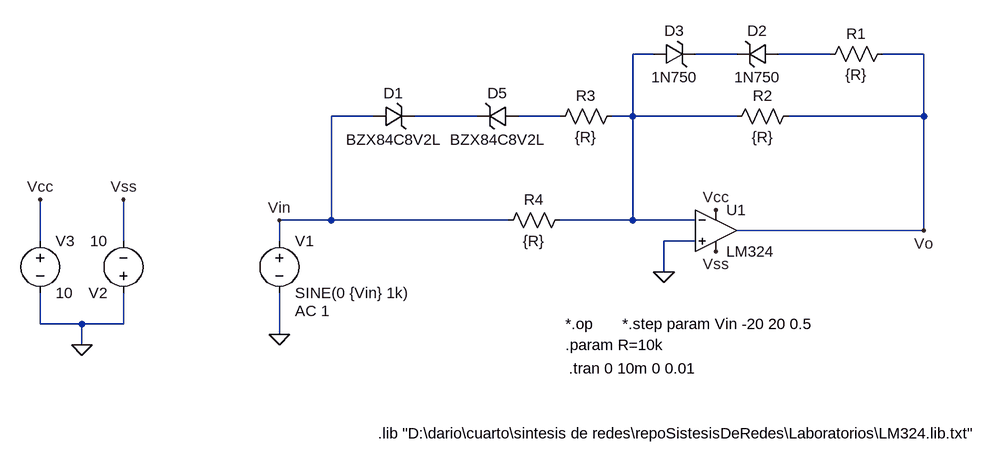
[diagram p0: schematic 1_16.asc]
1_16.asc, the LTspice schematic file:
Version 4
SHEET 1 1188 680
WIRE 240 -240 208 -240
WIRE 368 -240 304 -240
WIRE 512 -240 432 -240
WIRE 656 -240 592 -240
WIRE -192 -144 -256 -144
WIRE -32 -144 -128 -144
WIRE 96 -144 32 -144
WIRE 208 -144 208 -240
WIRE 208 -144 176 -144
WIRE 368 -144 208 -144
WIRE 656 -144 656 -240
WIRE 656 -144 448 -144
WIRE -256 16 -256 -144
WIRE -256 16 -336 16
WIRE 16 16 -256 16
WIRE 208 16 208 -144
WIRE 208 16 96 16
WIRE 304 16 208 16
WIRE 656 32 656 -144
WIRE 656 32 368 32
WIRE -704 48 -704 -16
WIRE -576 48 -576 -16
WIRE -336 48 -336 16
WIRE 304 48 256 48
WIRE 256 96 256 48
WIRE -704 176 -704 128
WIRE -640 176 -704 176
WIRE -576 176 -576 128
WIRE -576 176 -640 176
WIRE -336 192 -336 128
WIRE -640 208 -640 176
FLAG -336 192 0
FLAG 656 32 Vo
FLAG 256 96 0
FLAG -640 208 0
FLAG -704 -16 Vcc
FLAG -576 -16 Vss
FLAG 336 64 Vss
FLAG 336 0 Vcc
FLAG -336 16 Vin
SYMBOL Opamps\\opamp2 336 -32 R0
SYMATTR InstName U1
SYMATTR Value LM324
SYMBOL zener -192 -128 R270
WINDOW 0 36 32 VTop 2
WINDOW 3 -4 32 VBottom 2
SYMATTR InstName D1
SYMATTR Value BZX84C8V2L
SYMBOL zener 240 -224 R270
WINDOW 0 36 32 VTop 2
WINDOW 3 -4 32 VBottom 2
SYMATTR InstName D3
SYMATTR Value 1N750
SYMBOL zener 32 -160 R90
WINDOW 0 -4 32 VBottom 2
WINDOW 3 36 32 VTop 2
SYMATTR InstName D5
SYMATTR Value BZX84C8V2L
SYMBOL zener 432 -256 R90
WINDOW 0 -4 32 VBottom 2
WINDOW 3 36 32 VTop 2
SYMATTR InstName D2
SYMATTR Value 1N750
SYMBOL res 352 -128 R270
WINDOW 0 32 56 VTop 2
WINDOW 3 0 56 VBottom 2
SYMATTR InstName R2
SYMATTR Value {R}
SYMBOL res 496 -224 R270
WINDOW 0 32 56 VTop 2
WINDOW 3 0 56 VBottom 2
SYMATTR InstName R1
SYMATTR Value {R}
SYMBOL res 80 -128 R270
WINDOW 0 32 56 VTop 2
WINDOW 3 0 56 VBottom 2
SYMATTR InstName R3
SYMATTR Value {R}
SYMBOL res 0 32 R270
WINDOW 0 32 56 VTop 2
WINDOW 3 0 56 VBottom 2
SYMATTR InstName R4
SYMATTR Value {R}
SYMBOL voltage -336 32 R0
WINDOW 123 24 124 Left 2
WINDOW 39 0 0 Left 0
SYMATTR Value2 AC 1
SYMATTR InstName V1
SYMATTR Value SINE(0 {Vin} 1k)
SYMBOL voltage -704 32 R0
WINDOW 123 0 0 Left 0
WINDOW 39 0 0 Left 0
SYMATTR InstName V3
SYMATTR Value 10
SYMBOL voltage -576 144 R180
WINDOW 123 0 0 Left 0
WINDOW 39 0 0 Left 0
SYMATTR InstName V2
SYMATTR Value 10
TEXT -184 344 Left 2 !.lib "D:\\dario\\cuarto\\sintesis de redes\\repoSistesisDeRedes\\Laboratorios\\LM324.lib.txt"
TEXT 104 176 Left 2 !*.op
TEXT 104 208 Left 2 !.param R=10k
TEXT 192 176 Left 2 !*.step param Vin -20 20 0.5
TEXT 110 244 Left 2 !.tran 0 10m 0 0.01

The netlist it stands for:
* 1_16.asc
XU1 0 N001 Vcc Vss Vo LM324  ; pins In+ In- V+ V- OUT
D1 Vin N004 BZX84C8V2L
D3 N001 N002 1N750
D5 N005 N004 BZX84C8V2L
D2 N003 N002 1N750
R2 N001 Vo {R}
R1 N003 Vo {R}
R3 N005 N001 {R}
R4 Vin N001 {R}
V1 Vin 0 SINE(0 {Vin} 1k) AC 1
V3 Vcc 0 10
V2 0 Vss 10
.model D D
.lib standard.dio
.lib "D:\dario\cuarto\sintesis de redes\repoSistesisDeRedes\Laboratorios\LM324.lib.txt"
*.op
.param R=10k
*.step param Vin -20 20 0.5
.tran 0 10m 0 0.01
.backanno
.end